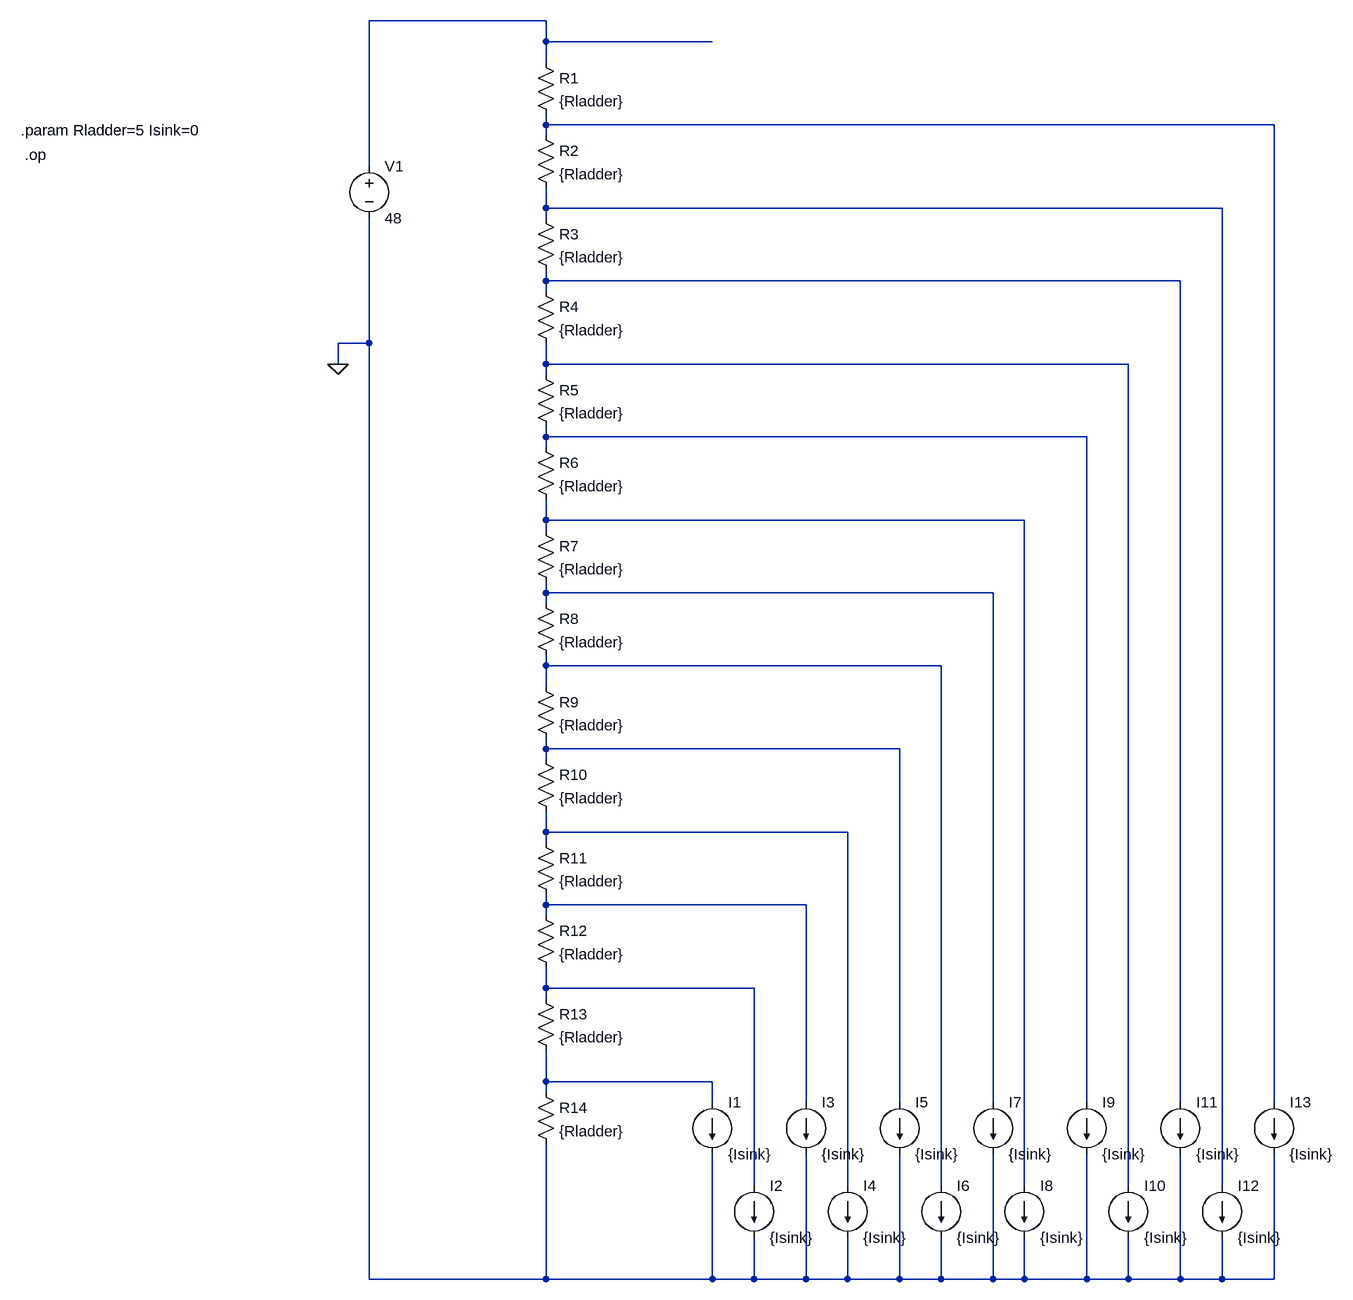
[diagram p0: schematic Battery Ladder.asc]
Battery Ladder.asc, the LTspice schematic file:
Version 4
SHEET 1 1508 1912
WIRE 64 -32 -208 -32
WIRE 64 0 64 -32
WIRE 320 0 64 0
WIRE 64 32 64 0
WIRE 64 128 64 112
WIRE 1184 128 64 128
WIRE 64 144 64 128
WIRE -208 192 -208 -32
WIRE 64 256 64 224
WIRE 1104 256 64 256
WIRE 64 272 64 256
WIRE 64 368 64 352
WIRE 1040 368 64 368
WIRE 64 384 64 368
WIRE -208 464 -208 272
WIRE -208 464 -256 464
WIRE -256 496 -256 464
WIRE 64 496 64 464
WIRE 960 496 64 496
WIRE 64 512 64 496
WIRE 64 608 64 592
WIRE 896 608 64 608
WIRE 64 624 64 608
WIRE 64 736 64 704
WIRE 800 736 64 736
WIRE 64 752 64 736
WIRE 64 848 64 832
WIRE 752 848 64 848
WIRE 64 864 64 848
WIRE 64 960 64 944
WIRE 672 960 64 960
WIRE 64 992 64 960
WIRE 64 1088 64 1072
WIRE 608 1088 64 1088
WIRE 64 1104 64 1088
WIRE 64 1216 64 1184
WIRE 528 1216 64 1216
WIRE 64 1232 64 1216
WIRE 64 1328 64 1312
WIRE 464 1328 64 1328
WIRE 64 1344 64 1328
WIRE 64 1456 64 1424
WIRE 384 1456 64 1456
WIRE 64 1472 64 1456
WIRE 64 1600 64 1552
WIRE 320 1600 64 1600
WIRE 64 1616 64 1600
WIRE 320 1632 320 1600
WIRE 464 1632 464 1328
WIRE 608 1632 608 1088
WIRE 752 1632 752 848
WIRE 896 1632 896 608
WIRE 1040 1632 1040 368
WIRE 1184 1632 1184 128
WIRE 384 1760 384 1456
WIRE 528 1760 528 1216
WIRE 672 1760 672 960
WIRE 800 1760 800 736
WIRE 960 1760 960 496
WIRE 1104 1760 1104 256
WIRE -208 1904 -208 464
WIRE 64 1904 64 1696
WIRE 64 1904 -208 1904
WIRE 320 1904 320 1712
WIRE 320 1904 64 1904
WIRE 384 1904 384 1840
WIRE 384 1904 320 1904
WIRE 464 1904 464 1712
WIRE 464 1904 384 1904
WIRE 528 1904 528 1840
WIRE 528 1904 464 1904
WIRE 608 1904 608 1712
WIRE 608 1904 528 1904
WIRE 672 1904 672 1840
WIRE 672 1904 608 1904
WIRE 752 1904 752 1712
WIRE 752 1904 672 1904
WIRE 800 1904 800 1840
WIRE 800 1904 752 1904
WIRE 896 1904 896 1712
WIRE 896 1904 800 1904
WIRE 960 1904 960 1840
WIRE 960 1904 896 1904
WIRE 1040 1904 1040 1712
WIRE 1040 1904 960 1904
WIRE 1104 1904 1104 1840
WIRE 1104 1904 1040 1904
WIRE 1184 1904 1184 1712
WIRE 1184 1904 1104 1904
FLAG -256 496 0
DATAFLAG 304 1456 ""
DATAFLAG 304 1328 ""
DATAFLAG 304 1216 ""
DATAFLAG 304 1088 ""
DATAFLAG 304 848 ""
DATAFLAG 304 736 ""
DATAFLAG 304 608 ""
DATAFLAG 304 496 ""
DATAFLAG 304 368 ""
DATAFLAG 304 256 ""
DATAFLAG 304 128 ""
DATAFLAG 304 0 ""
DATAFLAG 304 960 ""
DATAFLAG -128 1728 ""
DATAFLAG 304 1600 ""
SYMBOL res 48 16 R0
SYMATTR InstName R1
SYMATTR Value {Rladder}
SYMBOL voltage -208 176 R0
WINDOW 123 0 0 Left 0
WINDOW 39 0 0 Left 0
SYMATTR InstName V1
SYMATTR Value 48
SYMBOL res 48 128 R0
SYMATTR InstName R2
SYMATTR Value {Rladder}
SYMBOL res 48 256 R0
SYMATTR InstName R3
SYMATTR Value {Rladder}
SYMBOL res 48 368 R0
SYMATTR InstName R4
SYMATTR Value {Rladder}
SYMBOL res 48 496 R0
SYMATTR InstName R5
SYMATTR Value {Rladder}
SYMBOL res 48 608 R0
SYMATTR InstName R6
SYMATTR Value {Rladder}
SYMBOL res 48 736 R0
SYMATTR InstName R7
SYMATTR Value {Rladder}
SYMBOL res 48 848 R0
SYMATTR InstName R8
SYMATTR Value {Rladder}
SYMBOL res 48 976 R0
SYMATTR InstName R9
SYMATTR Value {Rladder}
SYMBOL res 48 1088 R0
SYMATTR InstName R10
SYMATTR Value {Rladder}
SYMBOL res 48 1216 R0
SYMATTR InstName R11
SYMATTR Value {Rladder}
SYMBOL res 48 1328 R0
SYMATTR InstName R12
SYMATTR Value {Rladder}
SYMBOL res 48 1456 R0
SYMATTR InstName R13
SYMATTR Value {Rladder}
SYMBOL res 48 1600 R0
SYMATTR InstName R14
SYMATTR Value {Rladder}
SYMBOL current 320 1632 R0
WINDOW 123 0 0 Left 0
WINDOW 39 0 0 Left 0
SYMATTR InstName I1
SYMATTR Value {Isink}
SYMBOL current 384 1760 R0
WINDOW 123 0 0 Left 0
WINDOW 39 0 0 Left 0
SYMATTR InstName I2
SYMATTR Value {Isink}
SYMBOL current 464 1632 R0
WINDOW 123 0 0 Left 0
WINDOW 39 0 0 Left 0
SYMATTR InstName I3
SYMATTR Value {Isink}
SYMBOL current 528 1760 R0
WINDOW 123 0 0 Left 0
WINDOW 39 0 0 Left 0
SYMATTR InstName I4
SYMATTR Value {Isink}
SYMBOL current 608 1632 R0
WINDOW 123 0 0 Left 0
WINDOW 39 0 0 Left 0
SYMATTR InstName I5
SYMATTR Value {Isink}
SYMBOL current 672 1760 R0
WINDOW 123 0 0 Left 0
WINDOW 39 0 0 Left 0
SYMATTR InstName I6
SYMATTR Value {Isink}
SYMBOL current 752 1632 R0
WINDOW 123 0 0 Left 0
WINDOW 39 0 0 Left 0
SYMATTR InstName I7
SYMATTR Value {Isink}
SYMBOL current 800 1760 R0
WINDOW 123 0 0 Left 0
WINDOW 39 0 0 Left 0
SYMATTR InstName I8
SYMATTR Value {Isink}
SYMBOL current 896 1632 R0
WINDOW 123 0 0 Left 0
WINDOW 39 0 0 Left 0
SYMATTR InstName I9
SYMATTR Value {Isink}
SYMBOL current 960 1760 R0
WINDOW 123 0 0 Left 0
WINDOW 39 0 0 Left 0
SYMATTR InstName I10
SYMATTR Value {Isink}
SYMBOL current 1040 1632 R0
WINDOW 123 0 0 Left 0
WINDOW 39 0 0 Left 0
SYMATTR InstName I11
SYMATTR Value {Isink}
SYMBOL current 1104 1760 R0
WINDOW 123 0 0 Left 0
WINDOW 39 0 0 Left 0
SYMATTR InstName I12
SYMATTR Value {Isink}
SYMBOL current 1184 1632 R0
WINDOW 123 0 0 Left 0
WINDOW 39 0 0 Left 0
SYMATTR InstName I13
SYMATTR Value {Isink}
TEXT -744 136 Left 2 !.param Rladder=5 Isink=0
TEXT -738 174 Left 2 !.op

The netlist it stands for:
* Battery Ladder.asc
R1 N001 N002 {Rladder}
V1 N001 0 48
R2 N002 N003 {Rladder}
R3 N003 N004 {Rladder}
R4 N004 N005 {Rladder}
R5 N005 N006 {Rladder}
R6 N006 N007 {Rladder}
R7 N007 N008 {Rladder}
R8 N008 N009 {Rladder}
R9 N009 N010 {Rladder}
R10 N010 N011 {Rladder}
R11 N011 N012 {Rladder}
R12 N012 N013 {Rladder}
R13 N013 N014 {Rladder}
R14 N014 0 {Rladder}
I1 N014 0 {Isink}
I2 N013 0 {Isink}
I3 N012 0 {Isink}
I4 N011 0 {Isink}
I5 N010 0 {Isink}
I6 N009 0 {Isink}
I7 N008 0 {Isink}
I8 N007 0 {Isink}
I9 N006 0 {Isink}
I10 N005 0 {Isink}
I11 N004 0 {Isink}
I12 N003 0 {Isink}
I13 N002 0 {Isink}
.param Rladder=5 Isink=0
.op
.backanno
.end